# Altium schematic sheet MS5611.SchDoc
size A4
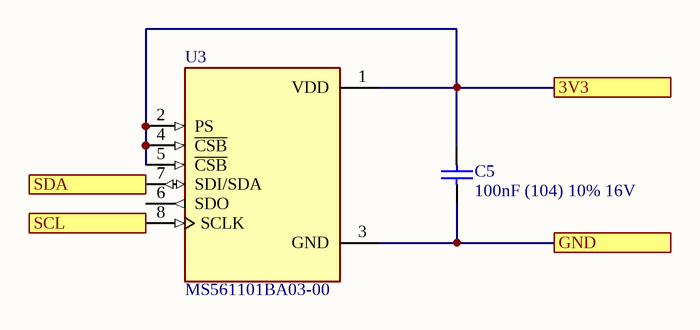
[diagram p0: MS5611.SchDoc]

## Parts
C5  100nF (104) 10% 16V  [0402_C]
U3  MS561101BA03-00  [SON125P500X300X100-8N]

## Ports
3V3, GND, SCL, SDA

## Nets
3V3: C5.2 U3.1(VDD) U3.2(PS) U3.4(~{CSB}) U3.5(~{CSB}) ; port 3V3
GND: C5.1 U3.3(GND) ; port GND
SCL: U3.8(SCLK) ; port SCL
SDA: U3.7(SDI/SDA) ; port SDA

Not connected (* = marked no-connect by the designer): U3 6(SDO)

## Library data of the parts
C5 = 0402 100nF (104) 10% 16V: 贴片电容; ComponentLink1Description: 供应商链接; ComponentLink1URL: http://www.szlcsc.com/product/details_1877.html; Package: 0402; Supplier: LC; SuppliersPartNumber: C1525
U3 = MS561101BA03-00: Pressure Sensor 1.44V to 3.6V 0.01bar to 1.2bar Absolute 8-Pin QFN Waffle Pack; MF: TE Connectivity; EU_RoHS_Compliance: Compliant; Price: None; Availability: Unavailable; TE_purchase_URL: https://www.te.com/usa-en/product-MS561101BA03-00.html?te_bu=Cor&te_type=disp&te_campaign=seda_glo_cor-seda-global-disp-prtnr-fy19-seda-model-bom-cta_sma-317_1&elqCampaignId=32493; Value: *; MP: MS561101BA03-00; SnapEDA_Link: https://www.snapeda.com/parts/MS561101BA03-00/TE%20Connectivity%20ALCOSWITCH%20Switches/view-part/287894/?ref=snap; Package: SMD-8 TE Connectivity